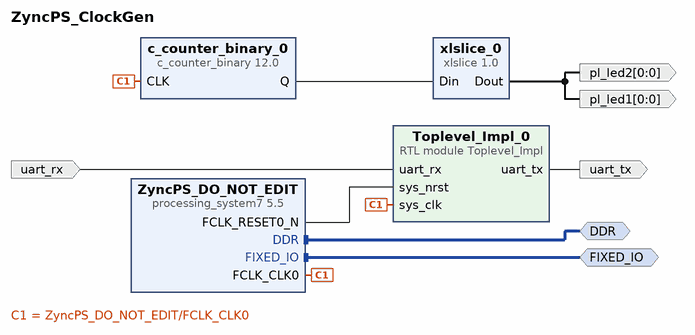
[diagram p0: block diagram of the top level]
# Vivado block design ZyncPS_ClockGen, xc7z007sclg225-1, Vivado 2022.2
create_bd_design ZyncPS_ClockGen

create_bd_intf_port -mode Master -vlnv xilinx.com:interface:ddrx_rtl:1.0 DDR
create_bd_intf_port -mode Master -vlnv xilinx.com:display_processing_system7:fixedio_rtl:1.0 FIXED_IO
create_bd_port -dir I uart_rx
create_bd_port -dir O uart_tx
create_bd_port -dir O -from 0 -to 0 -type data pl_led1
create_bd_port -dir O -from 0 -to 0 pl_led2

create_bd_cell -type ip -vlnv xilinx.com:ip:processing_system7:5.5 ZyncPS_DO_NOT_EDIT
set_property -dict [list \
  CONFIG.PCW_APU_CLK_RATIO_ENABLE 4:2:1 \
  CONFIG.PCW_APU_PERIPHERAL_FREQMHZ 50 \
  CONFIG.PCW_CPU_CPU_6X4X_MAX_RANGE 534 \
  CONFIG.PCW_DM_WIDTH 2 \
  CONFIG.PCW_DQS_WIDTH 2 \
  CONFIG.PCW_DQ_WIDTH 16 \
  CONFIG.PCW_ENET0_PERIPHERAL_ENABLE 0 \
  CONFIG.PCW_FCLK0_PERIPHERAL_CLKSRC {ARM PLL} \
  CONFIG.PCW_FPGA0_PERIPHERAL_FREQMHZ 50 \
  CONFIG.PCW_FPGA1_PERIPHERAL_FREQMHZ 100 \
  CONFIG.PCW_GPIO_MIO_GPIO_ENABLE 0 \
  CONFIG.PCW_MIO_PRIMITIVE 32 \
  CONFIG.PCW_PRESET_BANK1_VOLTAGE {LVCMOS 3.3V} \
  CONFIG.PCW_QSPI_GRP_FBCLK_ENABLE 1 \
  CONFIG.PCW_QSPI_GRP_FBCLK_IO {MIO 8} \
  CONFIG.PCW_QSPI_GRP_SINGLE_SS_ENABLE 1 \
  CONFIG.PCW_QSPI_GRP_SINGLE_SS_IO {MIO 1 .. 6} \
  CONFIG.PCW_QSPI_PERIPHERAL_ENABLE 1 \
  CONFIG.PCW_QSPI_QSPI_IO {MIO 1 .. 6} \
  CONFIG.PCW_SD0_PERIPHERAL_ENABLE 0 \
  CONFIG.PCW_SINGLE_QSPI_DATA_MODE x4 \
  CONFIG.PCW_UART1_PERIPHERAL_ENABLE 0 \
  CONFIG.PCW_UIPARAM_DDR_BUS_WIDTH {16 Bit} \
  CONFIG.PCW_UIPARAM_DDR_FREQ_MHZ 200 \
  CONFIG.PCW_UIPARAM_DDR_MEMORY_TYPE {DDR 3 (Low Voltage)} \
  CONFIG.PCW_UIPARAM_DDR_PARTNO {MT41K256M16 RE-125} \
  CONFIG.PCW_USB0_PERIPHERAL_ENABLE 0 \
  CONFIG.PCW_USE_M_AXI_GP0 0 \
] [get_bd_cells ZyncPS_DO_NOT_EDIT]
# 237 more settings of ZyncPS_DO_NOT_EDIT are not shown: defaults, MIO pin electricals, DDR timing, and values the tool derives
create_bd_cell -type ip -vlnv xilinx.com:ip:c_counter_binary:12.0 c_counter_binary_0
set_property -dict {CONFIG.Output_Width 25} [get_bd_cells c_counter_binary_0]
create_bd_cell -type ip -vlnv xilinx.com:ip:xlslice:1.0 xlslice_0
set_property -dict {CONFIG.DIN_FROM 24 CONFIG.DIN_TO 24 CONFIG.DIN_WIDTH 25} [get_bd_cells xlslice_0]
create_bd_cell -type module -reference Toplevel_Impl Toplevel_Impl_0

# ---- connections ----

connect_bd_intf_net -intf_net processing_system7_0_DDR [get_bd_intf_ports DDR] [get_bd_intf_pins ZyncPS_DO_NOT_EDIT/DDR]
connect_bd_intf_net -intf_net processing_system7_0_FIXED_IO [get_bd_intf_ports FIXED_IO] [get_bd_intf_pins ZyncPS_DO_NOT_EDIT/FIXED_IO]
connect_bd_net [get_bd_pins Toplevel_Impl_0/uart_tx] [get_bd_ports uart_tx]
connect_bd_net [get_bd_pins c_counter_binary_0/Q] [get_bd_pins xlslice_0/Din]
connect_bd_net -net processing_system7_0_FCLK_CLK0 [get_bd_pins ZyncPS_DO_NOT_EDIT/FCLK_CLK0] \
  [get_bd_pins c_counter_binary_0/CLK] [get_bd_pins Toplevel_Impl_0/sys_clk]
connect_bd_net -net processing_system7_0_FCLK_RESET0_N [get_bd_pins ZyncPS_DO_NOT_EDIT/FCLK_RESET0_N] [get_bd_pins Toplevel_Impl_0/sys_nrst]
connect_bd_net -net uart_rx_0_1 [get_bd_ports uart_rx] [get_bd_pins Toplevel_Impl_0/uart_rx]
connect_bd_net [get_bd_pins xlslice_0/Dout] [get_bd_ports pl_led2] [get_bd_ports pl_led1]

validate_bd_design
save_bd_design
